# Altium schematic sheet Storage.SchDoc: F1C100S-Storage
size A4
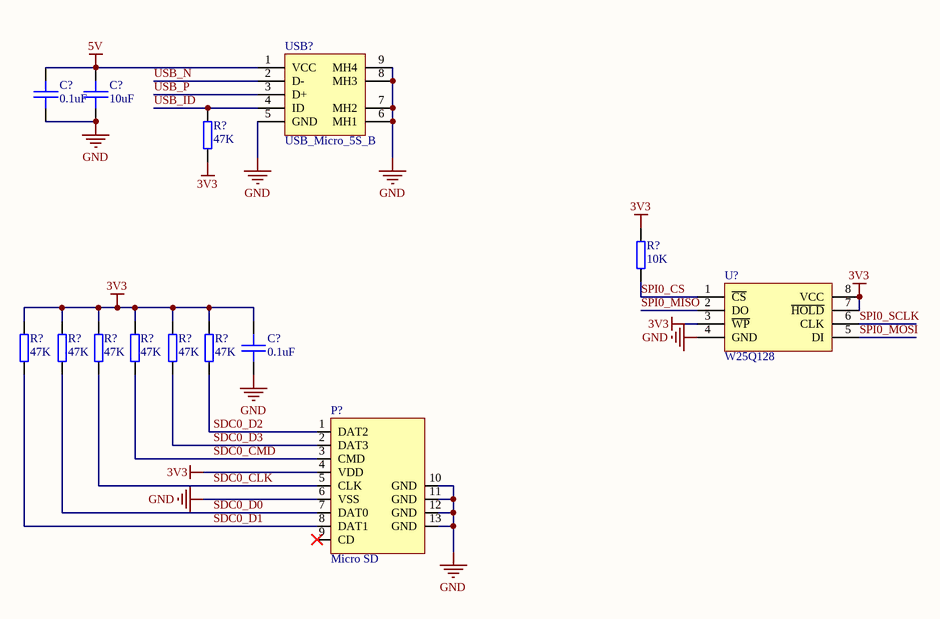
[diagram p0: Storage.SchDoc]

## Parts
(Parts that share a designator on the sheet are numbered #1, #2 ... from top to bottom, then left to right.)
C?#1  0.1uF  [CAP-0603]
C?#2  10uF  [CAP-1206]
C?#3  0.1uF  [CAP-0603]
P?  Micro SD  [7MSDP-B0-1012]
R?#1  47K  [RES-0603]
R?#2  10K  [RES-0603]
R?#3  47K  [RES-0603]
R?#4  47K  [RES-0603]
R?#5  47K  [RES-0603]
R?#6  47K  [RES-0603]
R?#7  47K  [RES-0603]
R?#8  47K  [RES-0603]
U?  W25Q128  [LC-SOP-8_208mil]
USB?  USB_Micro_5S_B  [USB_MICRO_5S_B]

## Nets
3V3: C?#3.1 P?.4(VDD) R?#1.2 R?#2.2 R?#3.2 R?#4.2 R?#5.2 R?#6.2 R?#7.2 R?#8.2 U?.3(~{WP}) U?.7(~{HOLD}) U?.8(VCC)
5V: C?#1.1 C?#2.1 USB?.1(VCC)
GND: C?#1.2 C?#2.2 C?#3.2 P?.6(VSS) P?.10(GND) P?.11(GND) P?.12(GND) P?.13(GND) U?.4(GND) USB?.5(GND) USB?.6(MH1) USB?.7(MH2) USB?.8(MH3) USB?.9(MH4)
SDC0_CLK: P?.5(CLK) R?#5.1
SDC0_CMD: P?.3(CMD) R?#6.1
SDC0_D0: P?.7(DAT0) R?#4.1
SDC0_D1: P?.8(DAT1) R?#3.1
SDC0_D2: P?.1(DAT2) R?#8.1
SDC0_D3: P?.2(DAT3) R?#7.1
SPI0_CS: R?#2.1 U?.1(~{CS})
SPI0_MISO: U?.2(DO)
SPI0_MOSI: U?.5(DI)
SPI0_SCLK: U?.6(CLK)
USB_ID: R?#1.1 USB?.4(ID)
USB_N: USB?.2(D-)
USB_P: USB?.3(D+)

Not connected (* = marked no-connect by the designer): P? 9(CD)*

## Notes on the sheet
- Title
- Size:
- Date:
- A4
- Number:
- Time:
- Revision:
- Sheet
- of
- File:

## Library data of the parts
C?#1 C?#3 = C_0603: 陶瓷贴片电容0603; tolerance: 10%; voltage: 50V; ESR: 1.73mOhm; IRMS: 5.59A; C_value: 0.1uF; Series: X7R
C?#2 = C_1206: 陶瓷贴片电容1206; tolerance: 10%; voltage: 50V; C_value: 10uF
P? = Micro SD: Micro SD卡座
R?#1-R?#8 = R_0603: 贴片电阻0603; tolerance: 5%; voltage: 50V; power: 0.063W
  R?#1 R?#3-R?#8: R_value: 47K
  R?#2: R_value: 10K
U? = W25Q128: 128Mbits SPI Flash
USB? = USB_Micro_5S_B: micro USB母座5SB型